# EAGLE design Pico_T420_Keyboard (EAGLE 9.6.2)
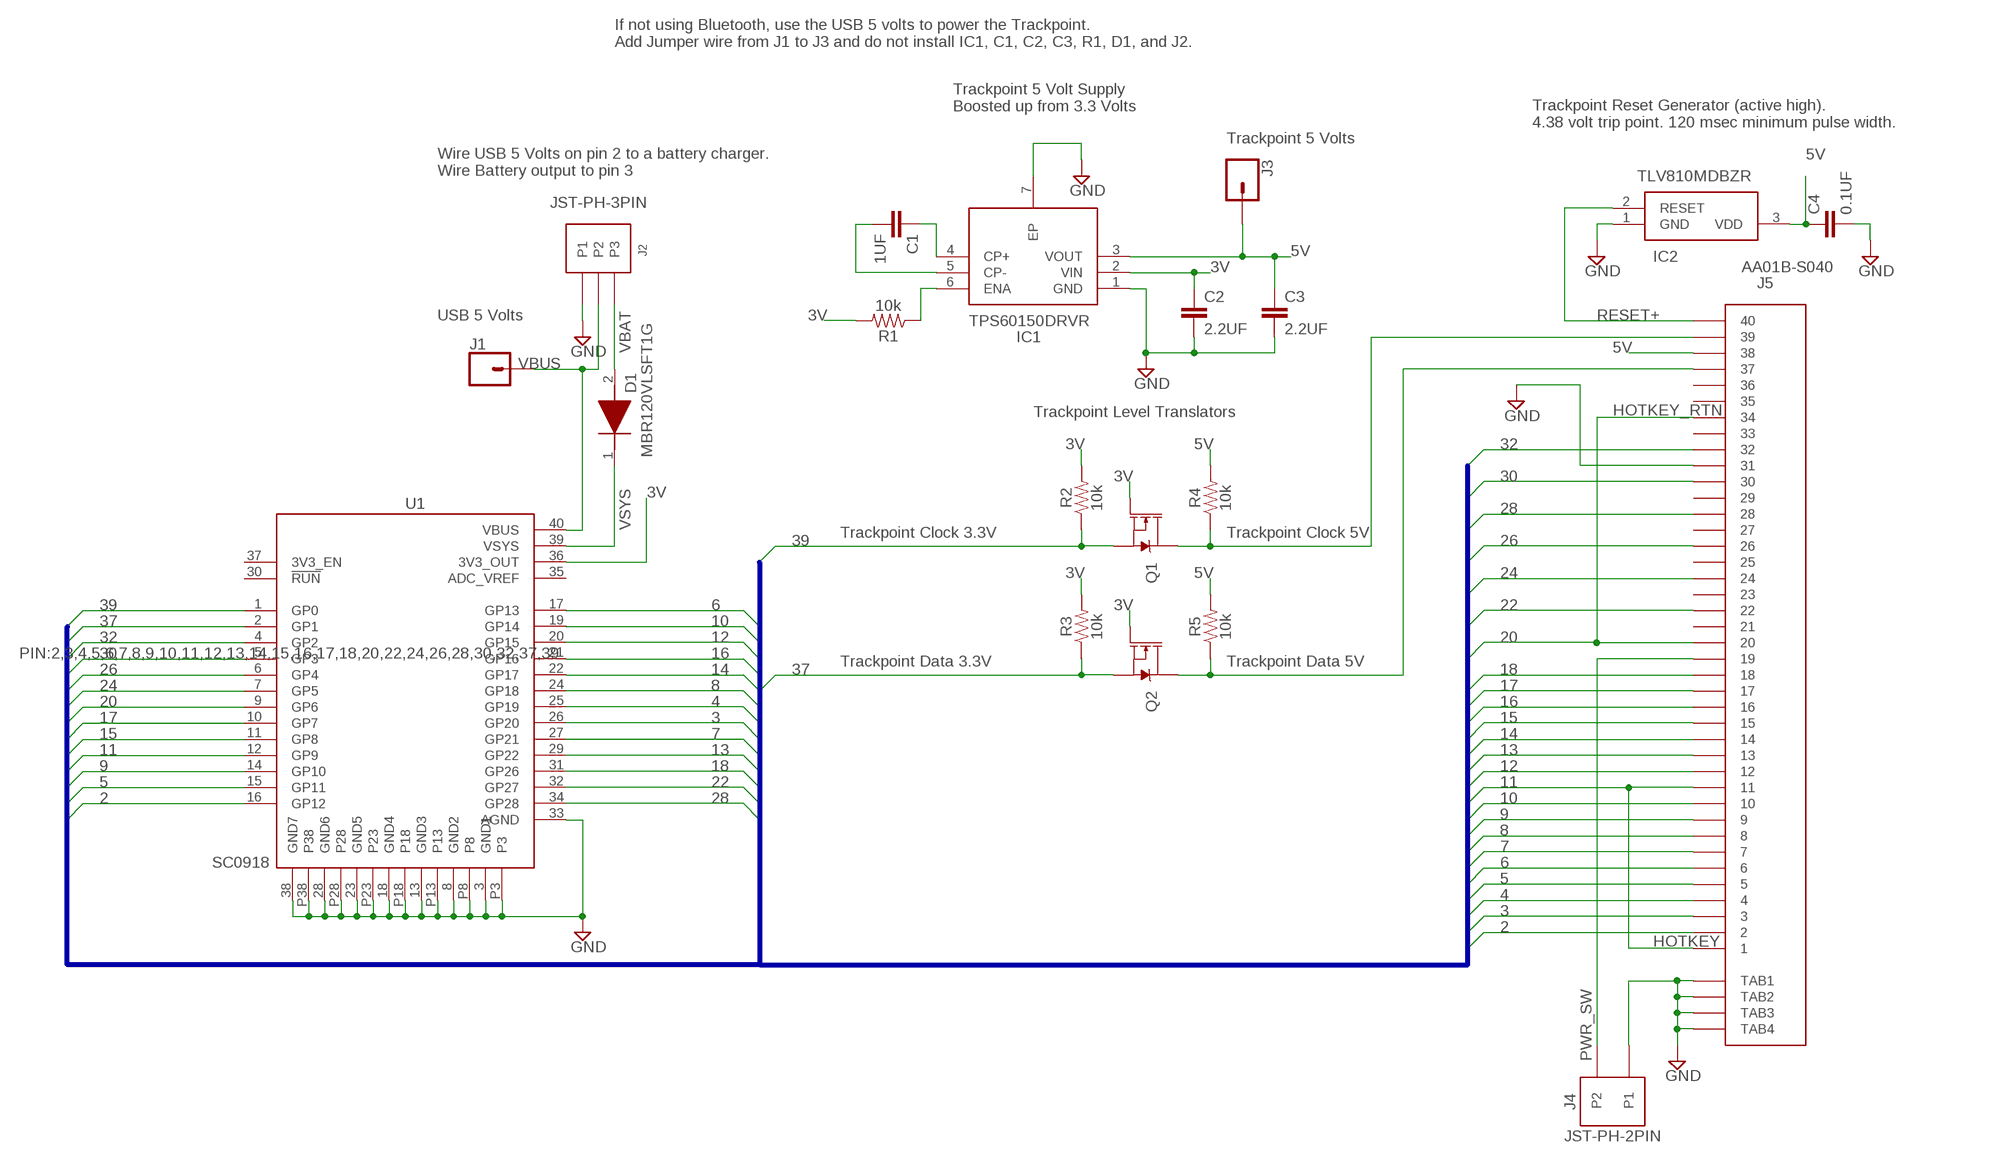
[diagram p0: schematic, sheet 1]

## Parts
C1  1UF  0603_CAP  [0603_CAP]
C2  2.2UF  0603_CAP  [0603_CAP]
C3  2.2UF  0603_CAP  [0603_CAP]
C4  0.1UF  0603_CAP  [0603_CAP]
D1  MBR120VLSFT1G  [SODFL3616X98N]
IC1  TPS60150DRVR  [SON65P200X200X80-7N]
IC2  TLV810MDBZR  [SOT95P237X112-3N]
J1  CONN_01  [1X01]
J2  JST-PH-3PIN  [JST-PH-3PIN]
J3  CONN_01  [1X01]
J4  JST-PH-2PIN  [JST-PH-2PIN]
J5  AA01B-S040  WM6787_A01B  [WM6787_AA01B]
Q1  220mA/50V/3.5Ω  MOSFET-NCH-BSS138  [SOT23-3]
Q2  220mA/50V/3.5Ω  MOSFET-NCH-BSS138  [SOT23-3]
R1  10k  10KOHM-0603-1/10W-1%  [0603]
R2  10k  10KOHM-0603-1/10W-1%  [0603]
R3  10k  10KOHM-0603-1/10W-1%  [0603]
R4  10k  10KOHM-0603-1/10W-1%  [0603]
R5  10k  10KOHM-0603-1/10W-1%  [0603]
U1  SC0918  [MODULE_SC0918]

## Nets
2: J5.P$2 U1.16(GP12)
3: J5.P$3 U1.26(GP20)
3V: C2.1 IC1.2(VIN) Q1.1(G) Q2.1(G) R1.2 R2.2 R3.2 U1.36(3V3_OUT)
4: J5.P$4 U1.25(GP19)
5: J5.P$5 U1.15(GP11)
5V: C3.1 C4.1 IC1.3(VOUT) IC2.3(VDD) J3.1 J5.P$38 R4.2 R5.2
6: J5.P$6 U1.17(GP13)
7: J5.P$7 U1.27(GP21)
8: J5.P$8 U1.24(GP18)
9: J5.P$9 U1.14(GP10)
10: J5.P$10 U1.19(GP14)
11: J5.P$1 J5.P$11 U1.12(GP9)
12: J5.P$12 U1.20(GP15)
13: J5.P$13 U1.29(GP22)
14: J5.P$14 U1.22(GP17)
15: J5.P$15 U1.11(GP8)
16: J5.P$16 U1.21(GP16)
17: J5.P$17 U1.10(GP7)
18: J5.P$18 U1.31(GP26)
20: J5.P$20 J5.P$34 U1.9(GP6)
22: J5.P$22 U1.32(GP27)
24: J5.P$24 U1.7(GP5)
26: J5.P$26 U1.6(GP4)
28: J5.P$28 U1.34(GP28)
30: J5.P$30 U1.5(GP3)
32: J5.P$32 U1.4(GP2)
37: Q2.2(S) R3.1 U1.2(GP1)
39: Q1.2(S) R2.1 U1.1(GP0)
GND: C2.2 C3.2 C4.2 IC1.1(GND) IC1.7(EP) IC2.1(GND) J2.P$1(P1) J4.P$1(P1) J5.P$31 J5.TAB1 J5.TAB2 J5.TAB3 J5.TAB4 U1.3(GND1) U1.8(GND2) U1.13(GND3) U1.18(GND4) U1.23(GND5) U1.28(GND6) U1.33(AGND) U1.38(GND7) U1.P3 U1.P8 U1.P13 U1.P18 U1.P23 U1.P28 U1.P38
N$2: C1.1 IC1.4(CP+)
N$3: C1.2 IC1.5(CP-)
N$6: IC1.6(ENA) R1.1
PWR_SW: J4.P$2(P2) J5.P$19
RESET+: IC2.2(RESET) J5.P$40
TP_CLK: J5.P$39 Q1.3(D) R4.1
TP_DATA: J5.P$37 Q2.3(D) R5.1
VBAT: D1.2(A) J2.P$3(P3)
VBUS: J1.1 J2.P$2(P2) U1.40(VBUS)
VSYS: D1.1(K) U1.39(VSYS)
Unconnected: J5.P$21 J5.P$23 J5.P$25 J5.P$27 J5.P$29 J5.P$33 J5.P$35 J5.P$36 U1.30(!RUN) U1.37(3V3_EN)

## Buses
PIN:2,3,4,5,6,7,8,9,10,11,12,13,14,15,16,17,18,20,22,24,26,28,30,32,37,39

## Notes on the sheet
- If not using Bluetooth, use the USB 5 volts to power the Trackpoint.
  Add Jumper wire from J1 to J3 and do not install IC1, C1, C2, C3, R1, D1, and J2.
- Trackpoint 5 Volt Supply
  Boosted up from 3.3 Volts
- Trackpoint Reset Generator (active high).
  4.38 volt trip point. 120 msec minimum pulse width.
- Trackpoint 5 Volts
- Wire USB 5 Volts on pin 2 to a battery charger.
  Wire Battery output to pin 3
- USB 5 Volts
- Trackpoint Level Translators | HOTKEY_RTN
- Trackpoint Clock 3.3V | Trackpoint Clock 5V
- Trackpoint Data 3.3V | Trackpoint Data 5V
- HOTKEY

## Power pins joined to a net without a drawn wire
ADC_VREF: U1.35(ADC_VREF)

## Library data of the parts
C1-C4 = 0603_CAP:0603_CAP
D1 = SamacSys_Parts:MBR120VLSFT1G: Diode Schottky 20V 1A SOD123FL ON Semi MBR120VLSFT1G, SMT Schottky Diode, 20V 1A, 2-Pin SOD-123FL Source: Datasheet <http://www.onsemi.com/pub/Collateral/MBR120VLSFT1-D.PDF>; DESCRIPTION: Diode Schottky 20V 1A SOD123FL ON Semi MBR120VLSFT1G, SMT Schottky Diode, 20V 1A, 2-Pin SOD-123FL; HEIGHT: 0.98mm; MANUFACTURER_NAME: onsemi; MANUFACTURER_PART_NUMBER: MBR120VLSFT1G; MOUSER_PART_NUMBER: 863-MBR120VLSFT1G; MOUSER_PRICE-STOCK: https://www.mouser.co.uk/ProductDetail/onsemi/MBR120VLSFT1G?qs=3JMERSakebpX%252BkItPpFCkg%3D%3D
IC1 = SamacSys_Parts:TPS60150DRVR: 140mA, 5V Charge Pump in 2x2 SON Source: Datasheet <http://componentsearchengine.com/Datasheets/1/TPS60150DRVR.pdf>; DESCRIPTION: 140mA, 5V Charge Pump in 2x2 SON; HEIGHT: 0.8mm; MANUFACTURER_NAME: Texas Instruments; MANUFACTURER_PART_NUMBER: TPS60150DRVR; MOUSER_PART_NUMBER: 595-TPS60150DRVR; MOUSER_PRICE-STOCK: https://www.mouser.co.uk/ProductDetail/Texas-Instruments/TPS60150DRVR?qs=IDSsxkoac0y%252BLx112%2Ft7nA%3D%3D
IC2 = SamacSys_Parts:TLV810MDBZR: 3-pin voltage supervisor (reset IC) with active-high, push-pull reset Source: Datasheet <http://www.ti.com/lit/gpn/tlv810>; DESCRIPTION: 3-pin voltage supervisor (reset IC) with active-high, push-pull reset; HEIGHT: 1.12mm; MANUFACTURER_NAME: Texas Instruments; MANUFACTURER_PART_NUMBER: TLV810MDBZR; MOUSER_PART_NUMBER: 595-TLV810MDBZR; MOUSER_PRICE-STOCK: https://www.mouser.co.uk/ProductDetail/Texas-Instruments/TLV810MDBZR?qs=L4ss%2FyqpMWTUak3ll30ykw%3D%3D
J1 J3 = SparkFun-Connectors:CONN_01: Single connection point. Often used as Generic Header-pin footprint for 0.1 inch spaced/style header connections On any of the 0.1 inch spaced packages, you can populate with these: Break Away Headers - Straight <https://www.sparkfun.com/products/116> (PRT-00116) Break Away Male Headers - Right Angle <https://www.sparkfun.com/products/553> (PRT-00553) Female Headers <https://www.sparkfun.com/products/115> (PRT-00115) Break Away Headers - Machine Pin <https://www.sparkfun.com/products/117> (PRT-00117) Break Away Female Headers - Swiss Machine Pin <https://www.sparkfun.com/products/743> (PRT-00743) This device is also useful as a general connection point to wire up your design to another part of your project. Our various solder wires solder well into these plated through hole pads. Hook-Up Wire - Assortment (Stranded, 22 AWG) <https://www.sparkfun.com/products/11375> (PRT-11375) Hook-Up Wire - Assortment (Solid Core, 22 AWG) <https://www.sparkfun.com/products/11367> (PRT-11367) View the entire wire category on our website here <https://www.sparkfun.com/categories/141> Special notes: SMTSO-256-ET is a "flush mount" nut for a 4-40 screw. We mostly use this on specialty testbeds; it is a nice way to connect hardware to your PCB at an adjustable hieght. Also note, the SNAP packages are for using a snappable style connector. We sell a baggie of snaps and they are also used on two LilyPad designs: Snap Assortment - 30 pack (male and female) <https://www.sparkfun.com/products/11347> (DEV-11347) LilyPad Arduino SimpleSnap <https://www.sparkfun.com/products/10941> (DEV-10941) LilyPad SimpleSnap Protoboard <https://www.sparkfun.com/products/10940> (DEV-10940)
J2 = JST-PH-3PIN:JST-PH-3PIN
J4 = JST-PH-2PIN:JST-PH-2PIN
J5 = WM6787_A01B:WM6787_A01B
Q1 Q2 = SparkFun-DiscreteSemi:MOSFET-NCH: N-channel MOSFETs Voltage controlled devices that allow control of high current outputs. SparkFun Products: SparkFun OpenScale <https://www.sparkfun.com/products/13261> SparkFun Digital Sandbox <https://www.sparkfun.com/products/12651> SparkFun Monster Moto Shield <https://www.sparkfun.com/products/10182> SparkFun MOSFET Power Controller <https://www.sparkfun.com/products/11214>; PROD_ID: TRANS-00830
R1-R5 = SparkFun-Resistors:10KOHM: 10kΩ resistor A resistor is a passive two-terminal electrical component that implements electrical resistance as a circuit element. Resistors act to reduce current flow, and, at the same time, act to lower voltage levels within circuits. - Wikipedia; PROD_ID: RES-00824
U1 = SC0918:SC0918: Check availability <https://pricing.snapeda.com/parts/SC0918/Raspberry%20Pi/view-part?ref=eda>; AVAILABILITY: In Stock; CHECK_PRICES: https://www.snapeda.com/parts/SC0918/Raspberry+Pi/view-part/?ref=eda; DESCRIPTION: - RP2040 Transceiver; 802.11 b/g/n (Wi-Fi, WiFi, WLAN), Bluetooth® 5.x 2.4GHz Evaluation Board; MF: Raspberry Pi; MP: SC0918; PACKAGE: None; PRICE: None; SNAPEDA_LINK: https://www.snapeda.com/parts/SC0918/Raspberry+Pi/view-part/?ref=snap

## Board
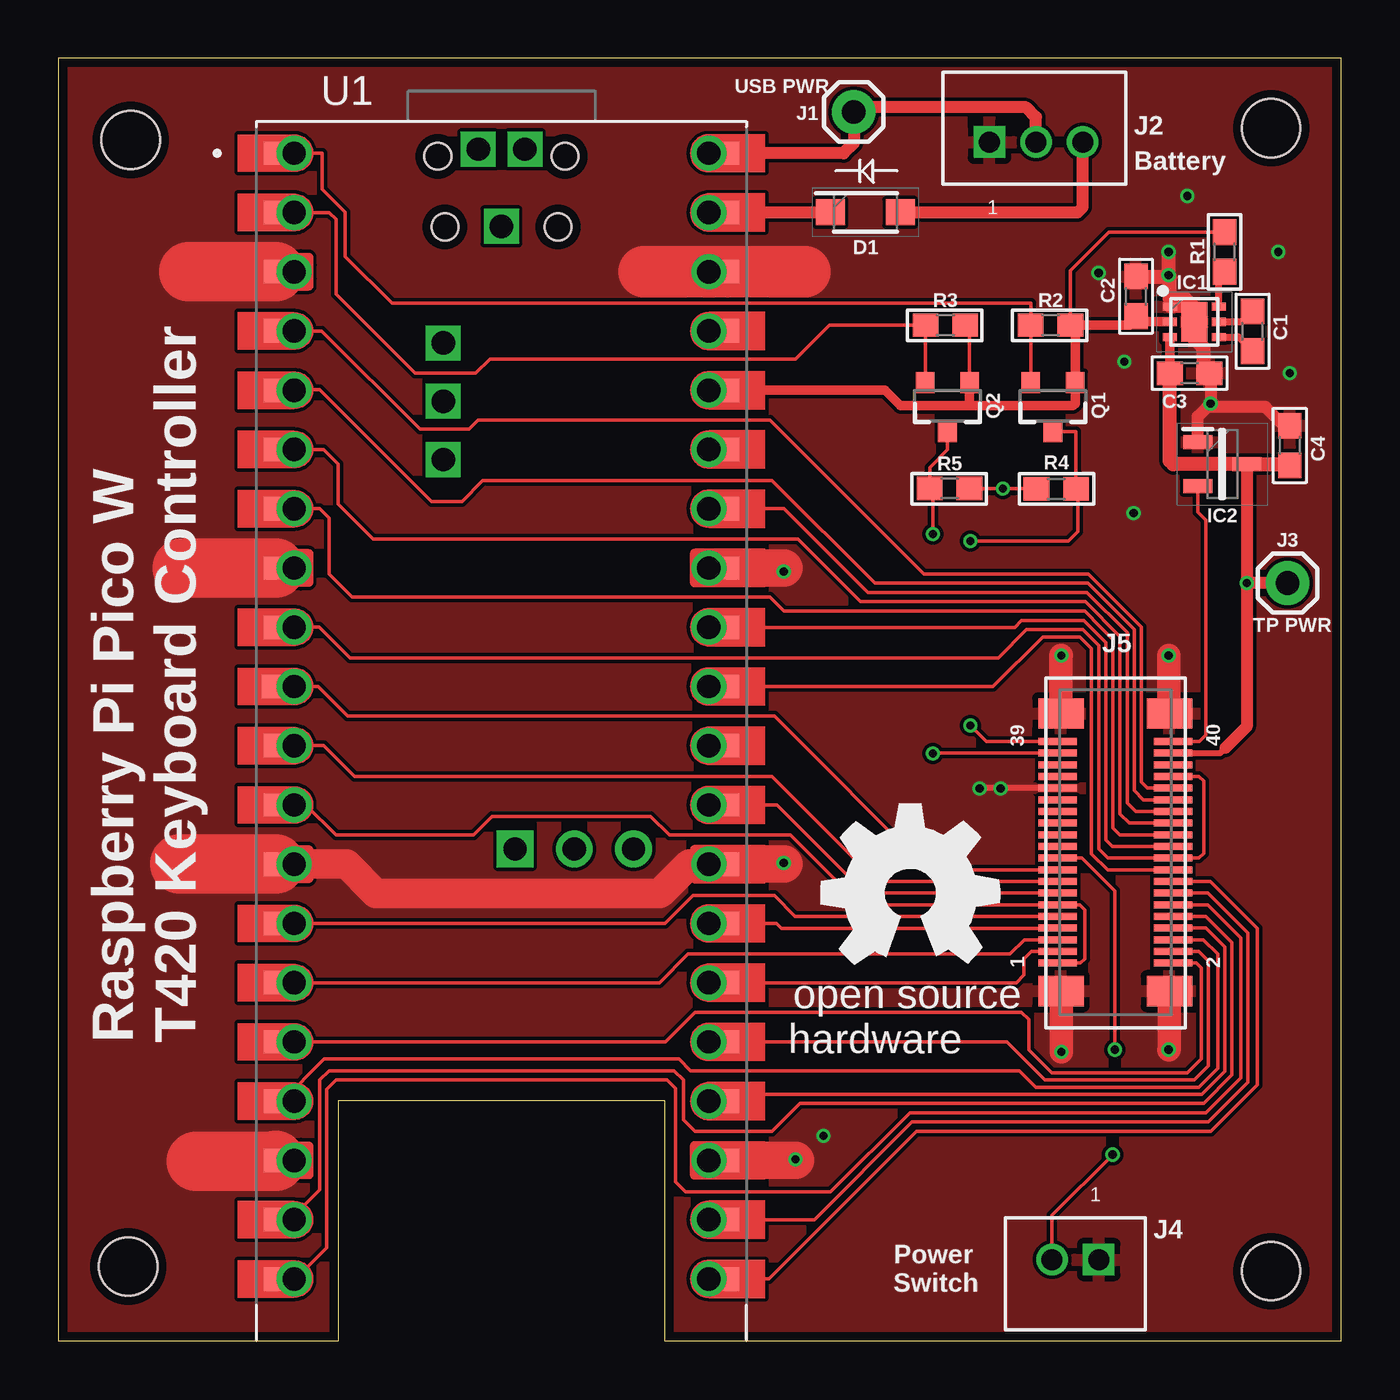
[diagram p1: board, top side]
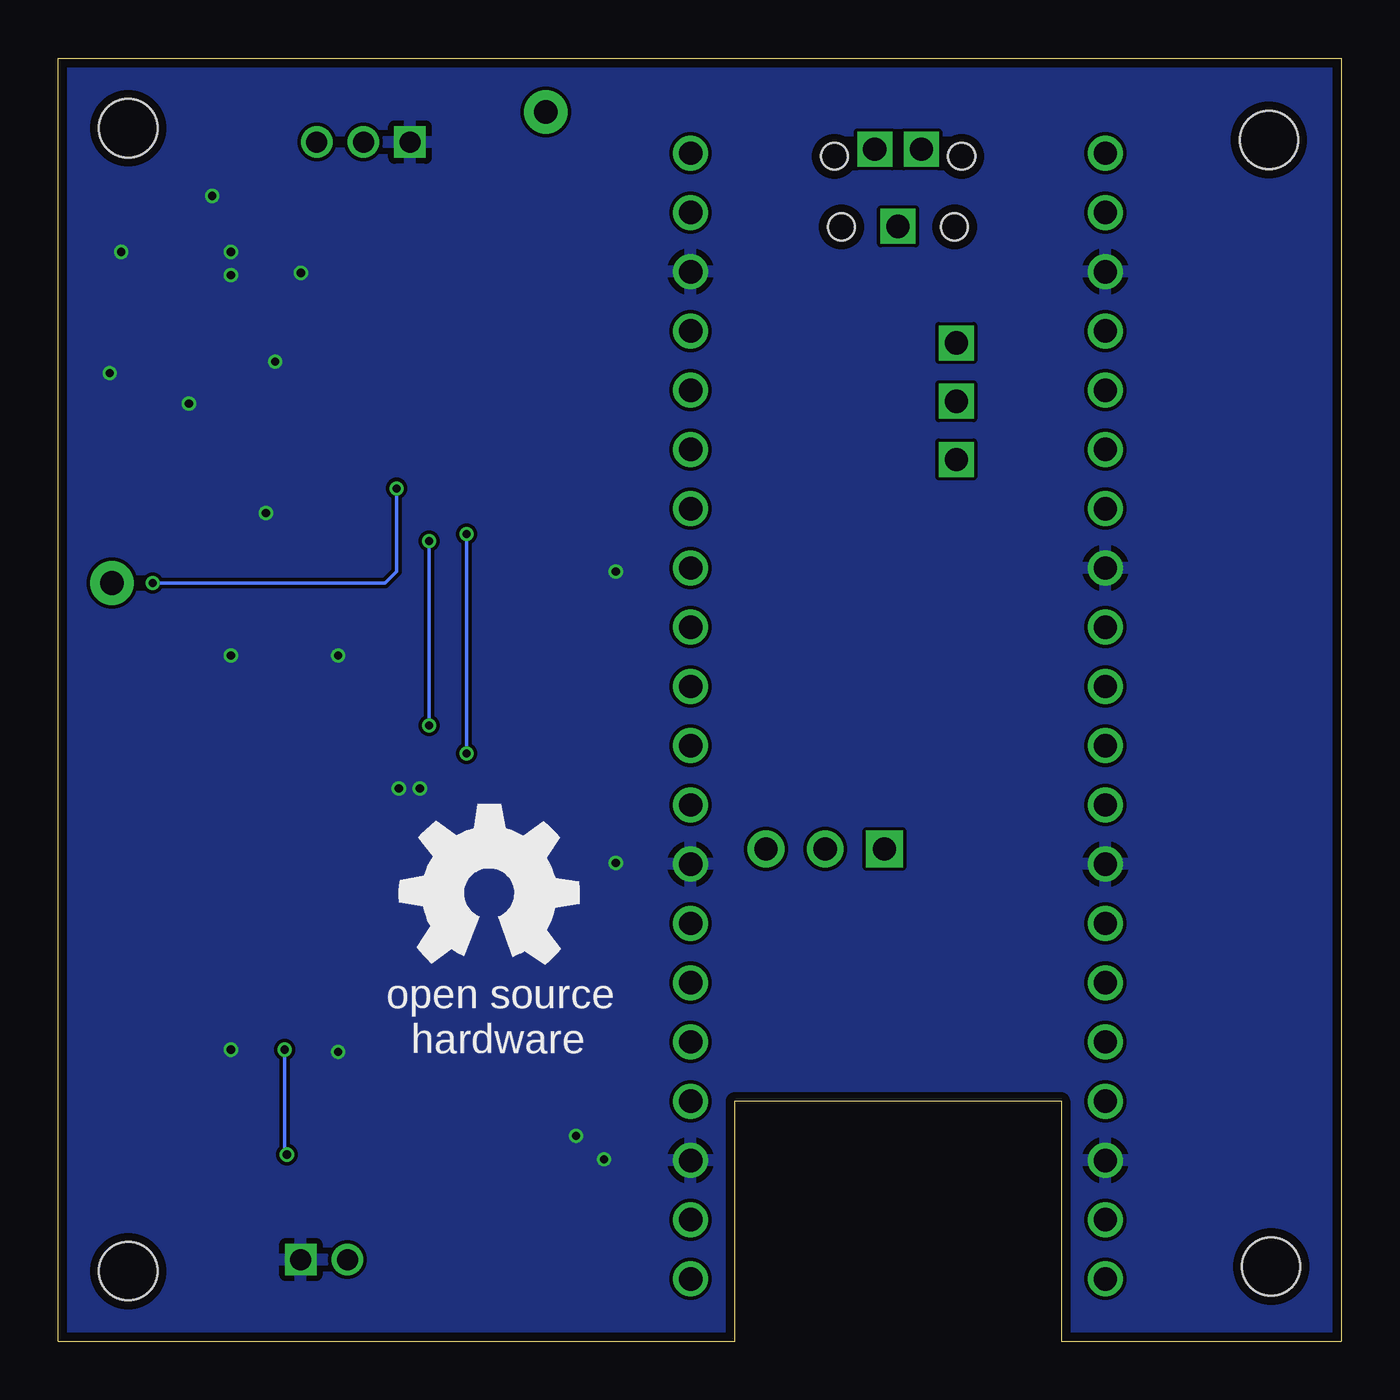
[diagram p2: board, bottom side, seen from below]

Size 55 x 55 mm. Coordinates in mm from the lower left corner, seen from the top.
Outline: 55,0 55,55 0,55 0,0 12,0 12,10.3 26,10.3 26,0 55,0
Copper layers (1*16): Top 0.035559375mm / dielectric 1.6mm / Bottom 0.035559375mm
Design rules "oshpark-2layer": minimum track width 6mil, minimum drill 10mil, track to track 6mil, track to pad 6mil, pad to pad 6mil, via to via 6mil, smd to smd 6mil, copper to edge 15mil, drill to drill 6mil, minimum pad ring 5mil, minimum via ring 5mil, stop-mask expansion 2.5mil, vias tented up to drill 0mil, thermal gap 10mil
Holes 2.5 mm at 52,52 52,3 3,3.2 3.1,51.5

### Footprints (pad centres in the part's own frame; a part is rotated, then mirrored left to right if it is on the bottom)
0603_CAP = smd 1.1 x 1: 1 -0.85,0; 2 0.85,0
SODFL3616X98N = smd 1.24 x 1.12: 1 -1.5,0; 2 1.5,0
SON65P200X200X80-7N = smd 0.6 x 0.35: 1 -1.05,0.65; 2 -1.05,0; 3 -1.05,-0.65; 4 1.05,-0.65; 5 1.05,0; 6 1.05,0.65 | smd 1.1 x 1.7: 7 0,0
SOT95P237X112-3N = smd 1.25 x 0.6: 1 -1.05,0.95; 2 -1.05,-0.95; 3 1.05,0
1X01 = drill 1.016 pad 1.88: 1 0,0
JST-PH-3PIN = drill 0.9 square: P$1 -2.98,0.01 | drill 0.9: P$2 -0.98,0.01; P$3 1.02,0.01
JST-PH-2PIN = drill 0.9 square: P$1 -1,0 | drill 0.9: P$2 1,0
WM6787_AA01B = smd 0.3 x 1.65: P$1 -4.7,2.57; P$2 -4.7,-2.37; P$3 -4.2,2.57; P$4 -4.2,-2.37; P$5 -3.7,2.57; P$6 -3.7,-2.37; P$7 -3.2,2.57; P$8 -3.2,-2.37; P$9 -2.7,2.57; P$10 -2.7,-2.37; P$11 -2.2,2.57; P$12 -2.2,-2.37; P$13 -1.7,2.57; P$14 -1.7,-2.37; P$15 -1.2,2.57; P$16 -1.2,-2.37; P$17 -0.7,2.57; P$18 -0.7,-2.37; P$19 -0.2,2.57; P$20 -0.2,-2.37; P$21 0.3,2.57; P$22 0.3,-2.37; P$23 0.8,2.57; P$24 0.8,-2.37; P$25 1.3,2.57; P$26 1.3,-2.37; P$27 1.8,2.57; P$28 1.8,-2.37; P$29 2.3,2.57; P$30 2.3,-2.37; P$31 2.8,2.57; P$32 2.8,-2.37; P$33 3.3,2.57; P$34 3.3,-2.37; P$35 3.8,2.57; P$36 3.8,-2.37; P$37 4.3,2.57; P$38 4.3,-2.37; P$39 4.8,2.57; P$40 4.8,-2.37 | smd 1.3 x 1.95: TAB1 -5.9,2.43; TAB2 -5.9,-2.22; TAB3 6,2.43; TAB4 6,-2.22
SOT23-3 = smd 0.8 x 0.9: 1 -0.95,-1; 2 0.95,-1; 3 0,1.1
0603 = smd 1.1 x 1: 1 -0.85,0; 2 0.85,0
MODULE_SC0918 = smd 1 x 1: 1 -9.69,24.13; 2 -9.69,21.59; 3 -9.69,19.05; 4 -9.69,16.51; 5 -9.69,13.97; 6 -9.69,11.43; 7 -9.69,8.89; 8 -9.69,6.35; 9 -9.69,3.81; 10 -9.79,1.27; 11 -9.69,-1.27; 12 -9.69,-3.81; 13 -9.69,-6.35; 14 -9.69,-8.89; 15 -9.69,-11.43; 16 -9.69,-13.97; 17 -9.69,-16.51; 18 -9.69,-19.05; 19 -9.69,-21.59; 20 -9.69,-24.13; 21 9.69,-24.13; 22 9.69,-21.59; 23 9.69,-19.05; 24 9.69,-16.51; 25 9.69,-13.97; 26 9.69,-11.43; 27 9.69,-8.89; 28 9.69,-6.35; 29 9.69,-3.81; 30 9.69,-1.27; 31 9.69,1.27; 32 9.69,3.81; 33 9.69,6.35; 34 9.69,8.89; 35 9.69,11.43; 36 9.69,13.97; 37 9.69,16.51; 38 9.69,19.05; 39 9.69,21.59; 40 9.69,24.13 | drill 1 pad 1.575 square: E 0.584,-5.7 | drill 1 pad 1.575: F 3.124,-5.7; G 5.664,-5.7 | drill 1: P1 -8.89,24.13; P2 -8.89,21.59; P3 -8.89,19.05; P4 -8.89,16.51; P5 -8.89,13.97; P6 -8.89,11.43; P7 -8.89,8.89; P8 -8.89,6.35; P9 -8.89,3.81; P10 -8.89,1.27; P11 -8.89,-1.27; P12 -8.89,-3.81; P13 -8.89,-6.35; P14 -8.89,-8.89; P15 -8.89,-11.43; P16 -8.89,-13.97; P17 -8.89,-16.51; P18 -8.89,-19.05; P19 -8.89,-21.59; P20 -8.89,-24.13; P21 8.89,-24.13; P22 8.89,-21.59; P23 8.89,-19.05; P24 8.89,-16.51; P25 8.89,-13.97; P26 8.89,-11.43; P27 8.89,-8.89; P28 8.89,-6.35; P29 8.89,-3.81; P30 8.89,-1.27; P31 8.89,1.27; P32 8.89,3.81; P33 8.89,6.35; P34 8.89,8.89; P35 8.89,11.43; P36 8.89,13.97; P37 8.89,16.51; P38 8.89,19.05; P39 8.89,21.59; P40 8.89,24.13 | drill 1 pad 1.5 square: TP1 0,21; TP2 1,24.3; TP3 -1,24.3; TP4 -2.5,16; TP5 -2.5,13.5; TP6 -2.5,11 | hole 1.15: -2.425,20.97; 2.425,20.97; -2.725,24; 2.725,24

### Placement (x,y rotation side)
C1  51.2,43.3 90 top
C2  46.2,44.8 90 top
C3  48.5,41.5 0 top
C4  52.8,38.4 90 top
D1  34.6,48.4 0 top
IC1  48.7,43.7 0 top
IC2  49.9,37.6 0 top
J1  34.1,52.7 0 top
J2  42.9,51.4 0 top
J3  52.7,32.5 0 top
J4  43.6,3.5 180 top
J5  45.42,20.91 90 top
Q1  42.64,40.1 180 top
Q2  38.12,40.1 180 top
R1  50,46.7 90 top
R2  42.54,43.56 0 top
R3  38.03,43.56 0 top
R4  42.78,36.54 180 top
R5  38.21,36.56 0 top
U1  19,26.8 0 top
U$1  [OSHW_8MM]  36.5,19.2 0 top
U$2  [OSHW_8MM]  36.5,19.2 0 top

### Tracks (layer width: path | path; a pad name or v marks a point on that pad's centre or on a via)
2
  Top 0.152: U1.16 26.03,12.83 27.3,14.1 41.3,14.1 41.6,13.8 41.6,12.5 42.6,11.5 48.4,11.5 49,12.1 49,16 48.79,16.21 J5.P$2
3
  Top 0.152: U1.26 41.07,15.37 41.4,15.7 41.4,16.4 41.71,16.71 J5.P$3
3V
  Top 0.152: Q2.1 39.07,43.37 R3.2 | R1.2 45.05,47.55 43.39,45.89 R2.2 43.6,43.56 43.6,43.35
  Top 0.254: Q1.1
  Top 0.305: 46.45,43.7 46.27,43.88 | 46.27,43.88 C2.1 | 45.96,43.56 46.27,43.88 | 39.07,40.27 38.9,40.1
  Top 0.406: 43.6,43.35 Q1.1 43.6,40.2 43.5,40.1 38.9,40.1 36.1,40.1 35.43,40.77 U1.36 | IC1.2 46.45,43.7 | R2.2 45.96,43.56 | Q2.1 39.07,40.27
4
  Top 0.152: J5.P$4 48.89,16.71 49.3,16.3 49.3,11.8 48.7,11.2 42.3,11.2 40.67,12.83 29.4,12.83 28.87,12.83 U1.25
5
  Top 0.152: U1.15 25.77,15.37 27,16.6 40.8,16.6 41.41,17.21 J5.P$5
5V  (via drill 0.35)
  Top 0.152: R5.2 v40.5,36.56 41.91,36.56
  Top 0.254: J5.P$38 49.81,25.21 50.05,25.45 | 41.91,36.56 R4.2
  Top 0.406: IC1.3 C3.1
  Top 0.508: 50.05,25.45 50.95,26.35 v50.95,32.5 | IC2.3 v50.95,32.5 | J3.1 v50.95,32.5 | 52.75,37.6 C4.1
  Top 0.61: 52.75,37.6 IC2.3 47.8,37.6 47.65,37.75 C3.1
  Bottom 0.152: v40.5,36.56 40.5,33 41,32.5 v50.95,32.5
6
  Top 0.152: U1.17 9.59,10.29 11.4,12.1 26.6,12.1 27.1,11.6 41.2,11.6 41.91,10.89 48.89,10.89 49.7,11.7 49.7,16.6 49.09,17.21 J5.P$6
7
  Top 0.152: U1.27 30.79,17.91 31,17.7 J5.P$7
8
  Top 0.152: U1.24 29.89,10.29 30.19,10.59 49.02,10.59 50.01,11.57 50.01,16.89 49.19,17.71 J5.P$8
9
  Top 0.152: U1.14 26.01,17.91 27.2,19.1 30.7,19.1 31.59,18.21 J5.P$9
10
  Top 0.152: U1.19 9.91,5.21 11.2,6.5 11.2,11.2 11.6,11.6 26.4,11.6 26.8,11.2 26.8,9.5 27.3,9 30.6,9 31.8,10.2 49.1,10.2 50.31,11.41 50.31,17.09 49.19,18.21 J5.P$10
11
  Top 0.152: J5.P$1 43.81,16.21 44,16.4 44,18.5 43.79,18.71 J5.P$11 34.39,18.71 31.4,21.7 26.2,21.7 25.4,22.5 18.6,22.5 17.8,21.7 11.9,21.7 10.61,22.99 U1.12
12
  Top 0.152: U1.20 10.17,2.67 11.51,4 11.51,10.8 11.9,11.2 26.1,11.2 26.46,10.84 26.46,6.84 26.9,6.4 33.1,6.4 36.5,9.8 49.2,9.8 50.7,11.3 50.7,17.3 49.29,18.71 J5.P$12
13
  Top 0.152: U1.29 30.81,22.99 34.59,19.21 J5.P$13
14
  Top 0.152: U1.22 32.41,5.21 36.6,9.4 49.3,9.4 51.01,11.11 51.01,17.5 49.29,19.21 J5.P$14
15
  Top 0.152: J5.P$15 35.09,19.71 30.6,24.2 12.7,24.2 11.37,25.53 U1.11
16
  Top 0.152: J5.P$16 49.39,19.71 51.4,17.7 51.4,11 49.4,9 36.8,9 30.47,2.67 U1.21
17
  Top 0.152: U1.10 11.13,28.07 12.4,26.8 30.7,26.8 37.29,20.21 J5.P$17
18
  Top 0.152: J5.P$18 44.99,20.21 44.3,20.9 44.3,29.7 43.8,30.2 42.2,30.2 40.07,28.07 U1.31
20
  Top 0.152: U1.9 11.19,30.61 12.5,29.3 40.3,29.3 41.51,30.5 43.93,30.5 44.6,29.83 44.6,21.1 44.99,20.71 J5.P$20 48.9,20.71 49.1,20.91 49.1,24.01 48.9,24.21 J5.P$34
22
  Top 0.152: J5.P$22 45.19,21.21 44.91,21.49 44.91,29.95 43.96,30.9 41.3,30.9 41,30.6 28.88,30.6 28.87,30.61 U1.32
24
  Top 0.152: J5.P$24 45.5,21.71 45.21,22 45.21,30.08 44.7,30.59 44.7,30.6 44,31.3 31.1,31.3 30.5,31.9 12.6,31.9 11.6,32.9 11.6,35.3 11.2,35.7 11.19,35.69 U1.7
26
  Top 0.152: J5.P$26 45.91,22.21 45.52,22.6 45.52,30.21 44.03,31.7 34.4,31.7 31.7,34.4 13.5,34.4 12,35.9 12,37.6 11.37,38.23 U1.6
28
  Top 0.152: J5.P$28 46.19,22.71 45.82,23.08 45.82,30.38 44.1,32.1 34.7,32.1 31.1,35.7 U1.34
30
  Top 0.152: J5.P$30 46.52,23.21 46.13,23.6 46.13,30.5 44.13,32.5 35,32.5 30.6,36.9 18.2,36.9 17.3,36 16,36 11.2,40.8 9.34,40.8 U1.5
32
  Top 0.152: J5.P$32 46.69,23.71 46.43,23.97 46.43,30.63 44.16,32.9 37.1,32.9 30.5,39.5 18,39.5 17.6,39.1 15.5,39.1 11.29,43.31 U1.4
37
  Top 0.152: Q2.2 R3.1 33.06,43.56 31.6,42.1 18.5,42.1 17.9,41.5 15.3,41.5 11.9,44.9 11.9,48.1 11.61,48.39 U1.2
39
  Top 0.152: U1.1 11.3,50.93 11.3,49.4 12.3,48.4 12.3,46.5 14.3,44.5 41.69,44.5 R2.1 Q1.2
GND  (via drill 0.35)
  Top 0.152: U1.P3 U1.3 | U1.P8 U1.8 | U1.P13 U1.13 | U1.P23 U1.23 | U1.P28 28,20.45 U1.28
  Top 0.254: J5.P$31 v39.5,23.71 v39.5,23.7
  Top 0.508: C3.2 49.4,41.45 v49.4,40.2 49.25,40.05 | IC2.1 48.85,39.65 49.25,40.05 | C4.2 52.55,39.25 51.75,40.05 49.25,40.05 | IC1.1 48.6,44.35 48.6,44.4
  Top 0.61: 47.65,45.55 47.65,44.7 48.3,44.7 48.6,44.4 48.6,43.8 IC1.7 48.7,43 48.99,42.71 48.99,42.69 49.1,42.58 49.1,41.75 C3.2 | 47.65,45.55 47.6,45.6 | 47.6,45.6 v47.6,45.7 | C2.2 47.55,45.65 47.6,45.6 | v47.6,45.7 v47.6,46.7 | v47.6,45.7 47.65,45.65 47.65,45.55
  Top 1.016: J5.TAB2 47.64,12.54 v47.6,12.5 | J5.TAB1 v43,12.4 | J5.TAB4 47.6,26.95 v47.6,29.4 | J5.TAB3 v42.99,29.39 v43,29.4 | 31.1,33.15 v31.1,33 | 31.1,20.45 v31.1,20.5 | 31.6,7.75 v31.6,7.8
  Top 1.27: U1.P13 12.35,20.45 13.6,19.2 25.8,19.2 27.05,20.45 28,20.45
  Top 1.6: 31.1,33.15 U1.33 | U1.28 31.1,20.45 | U1.23 31.6,7.75
  Top 2.2: 32,45.85 U1.38 25.1,45.85
  Top 2.54: U1.18 9.31,7.7 5.9,7.7 | U1.13 5.2,20.45 | U1.8 5.3,33.15 | U1.3 5.6,45.85
  other vias: 40.4,23.7 32.8,8.8 45.7,42 44.6,45.8 52.8,41.5 52.3,46.7 48.4,49.1 46.1,35.5
  pour Top: 0,-0.1 0,54.9 55,54.9 55,-0.1 26,-0.1 26,10.2 12,10.2 12,-0.1
  pour Bottom: -0.1,-0.1 -0.1,54.9 55.1,54.9 55.1,-0.1 26,-0.1 26,10.2 12,10.2 12,-0.1
N$2
  Top 0.305: IC1.4 50.6,43.05 C1.1
N$3
  Top 0.305: C1.2 50.75,43.7 IC1.5
N$6
  Top 0.305: IC1.6 49.75,45.6 R1.1
PWR_SW  (via drill 0.35)
  Top 0.152: J5.P$19 43.89,20.71 45.3,19.3 v45.3,12.5 | v45.2,8 42.6,5.4 J4.P$2
  Bottom 0.152: v45.3,12.5 45.3,8.1 v45.2,8
RESET+
  Top 0.152: J5.P$40 48.91,25.71 49.2,26 49.2,35.2 48.85,35.55 IC2.2
TP_CLK  (via drill 0.35)
  Top 0.152: J5.P$39 39.79,25.71 v39.1,26.4 | v39.1,34.3 43.3,34.3 43.7,34.7 43.7,36.54 R4.1 43.63,39 Q1.3
  Bottom 0.152: v39.1,26.4 v39.1,34.3
TP_DATA  (via drill 0.35)
  Top 0.152: J5.P$37 v37.51,25.21 v37.5,25.2 | Q2.3 38.12,38.22 37.36,37.46 R5.1 37.5,36.56 v37.5,34.6
  Bottom 0.152: v37.5,25.2 v37.5,34.6
VBAT
  Top 0.508: D1.2 43.7,48.4 43.92,48.62 J2.P$3
VBUS
  Top 0.508: U1.40 33.67,50.93 34.1,51.36 J1.1 34.3,52.9 41.5,52.9 41.92,52.48 J2.P$2
VSYS
  Top 0.508: U1.39 D1.1

### Text on the board
tPlace: USB PWR | Battery | C2 | C1 | C3 | C4 | TP PWR | Raspberry Pi Pico W / T420 Keyboard Controller | Power / Switch